# Altium project SIPROKAR_TempSens.PrjPcb
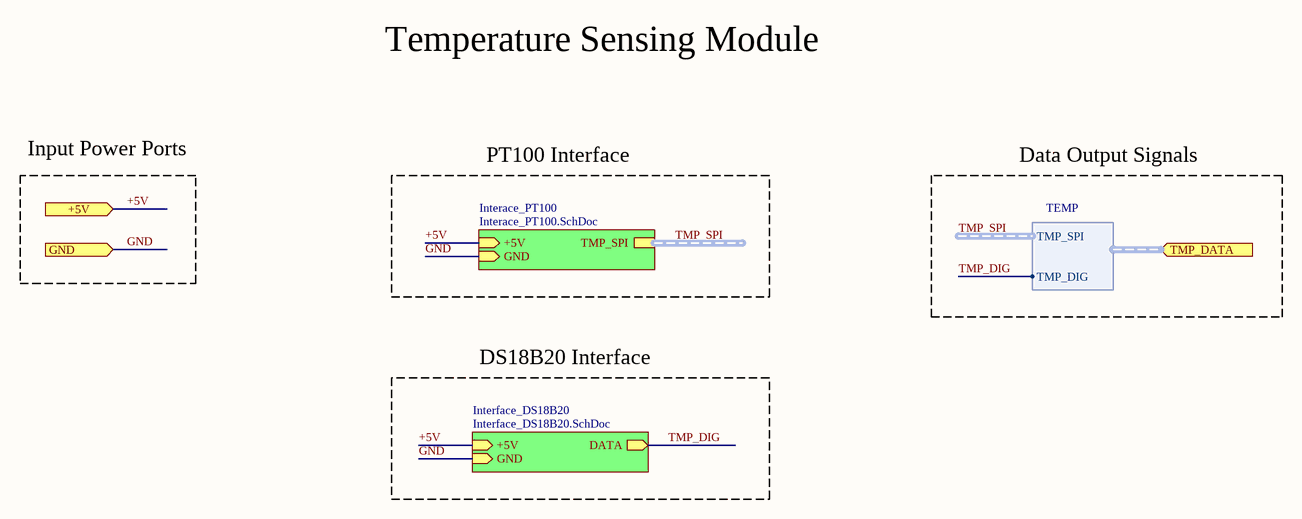
[diagram p0: Temperarute_Sensing_Module.SchDoc]
3 sheets, 4 parts. Net scope: hierarchical (ports join the sheet entries above them; power ports are global).
Sheets:
  Temperarute_Sensing_Module.SchDoc
    Interace_PT100 = Interace_PT100.SchDoc
    Interface_DS18B20 = Interface_DS18B20.SchDoc

## Sheet Temperarute_Sensing_Module.SchDoc
size A4

### Sub-sheets
Interace_PT100 = Interace_PT100.SchDoc: GND (in), +5V (in), TMP_SPI (harness TMP_SPI)
Interface_DS18B20 = Interface_DS18B20.SchDoc: GND (in), +5V (in), DATA (out)

### Ports
+5V (in), GND (in), TMP_DATA (in, harness TEMP)

### Harnesses
TEMP: TMP_SPI, TMP_DIG

### Nets
+5V: port +5V, sheet Interace_PT100/+5V, sheet Interface_DS18B20/+5V
GND: port GND, sheet Interace_PT100/GND, sheet Interface_DS18B20/GND
TMP_DIG: sheet Interface_DS18B20/DATA, port TMP_DATA.TMP_DIG  [project net DATA]

### Buses and harness runs
harness TMP_SPI = sheet Interace_PT100/TMP_SPI

### Notes on the sheet
- Temperature Sensing Module
- Input Power Ports
- PT100 Interface
- Data Output Signals
- DS18B20 Interface

## Sheet Interace_PT100.SchDoc
size A4
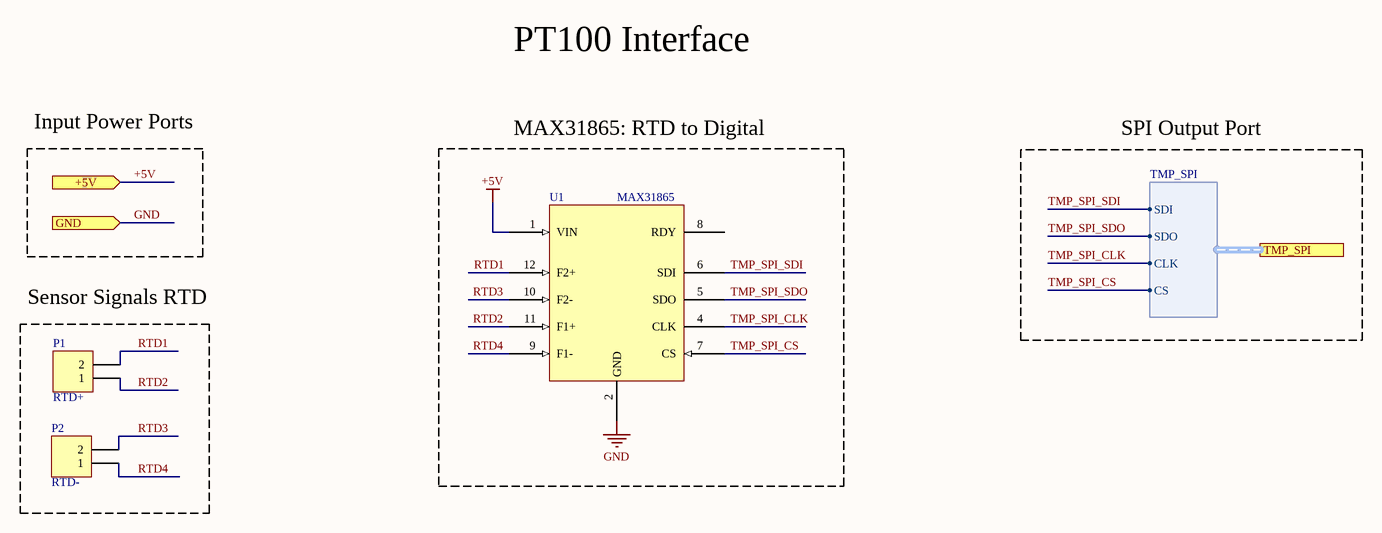
[diagram p1: Interace_PT100.SchDoc]

### Parts
P1  RTD+  [HDR1X2]
P2  RTD-  [HDR1X2]
U1  MAX31865

### Blocks framed on the sheet
MAX31865: RTD to Digital: U1
Sensor Signals RTD: P1 P2

### Ports
+5V (in), GND (in), TMP_SPI (harness TMP_SPI)

### Harnesses
TMP_SPI: SDI, SDO, CLK, CS

### Nets
+5V: U1.1(VIN) ; port +5V
GND: U1.2(GND) ; port GND
RTD1: P1.2 U1.12(F2+)
RTD2: P1.1 U1.11(F1+)
RTD3: P2.2 U1.10(F2-)
RTD4: P2.1 U1.9(F1-)
TMP_SPI_CLK: U1.4(CLK) ; port TMP_SPI.CLK  [project net TMP_SPI.CLK]
TMP_SPI_CS: U1.7(CS) ; port TMP_SPI.CS  [project net TMP_SPI.CS]
TMP_SPI_SDI: U1.6(SDI) ; port TMP_SPI.SDI  [project net TMP_SPI.SDI]
TMP_SPI_SDO: U1.5(SDO) ; port TMP_SPI.SDO  [project net TMP_SPI.SDO]

Not connected (* = marked no-connect by the designer): U1 8(RDY)

### Notes on the sheet
- PT100 Interface
- Input Power Ports
- SPI Output Port

### Library data of the parts
P1 P2 = Header 2: Header, 2-Pin; System: Connector; LatestRevisionDate: 17-Jul-2002; LatestRevisionNote: Re-released for DXP Platform.; Publisher: Altium Limited
U1 = Adafruit MAX31865: Easy-to-use resistance-to-digital converter optimized for platinum resistance temperature detectors (RTDs)

## Sheet Interface_DS18B20.SchDoc
size A4
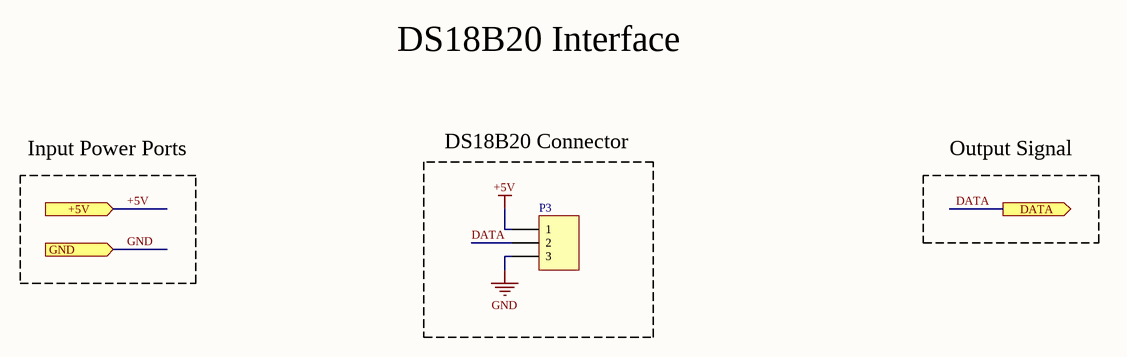
[diagram p2: Interface_DS18B20.SchDoc]

### Parts
P3  DS18B20 Connector  [HDR1X3]  (value not drawn)

### Blocks framed on the sheet
DS18B20 Connector: P3

### Ports
+5V (in), DATA (out), GND (in)

### Nets
+5V: P3.1 ; port +5V
GND: P3.3 ; port GND
DATA: P3.2 ; port DATA

### Notes on the sheet
- DS18B20 Interface
- Input Power Ports
- Output Signal

### Library data of the parts
P3 = CMP-002-00161-1: Header, 3-Pin; LatestRevisionDate: 17-Jul-2002; Source: Miscellaneous Connectors.SchLib; Design Item ID: Header 3; Component Type: Standard; LatestRevisionNote: Re-released for DXP Platform.; Signal Integrity: Connector; Publisher: Altium Limited; Pins: 3

## Nets that join several sheets
+5V: Interace_PT100 (U1.1), Interface_DS18B20 (P3.1)
GND: Interace_PT100 (U1.2), Interface_DS18B20 (P3.3)